# Altium project M1_C5_version1.PrjPcb
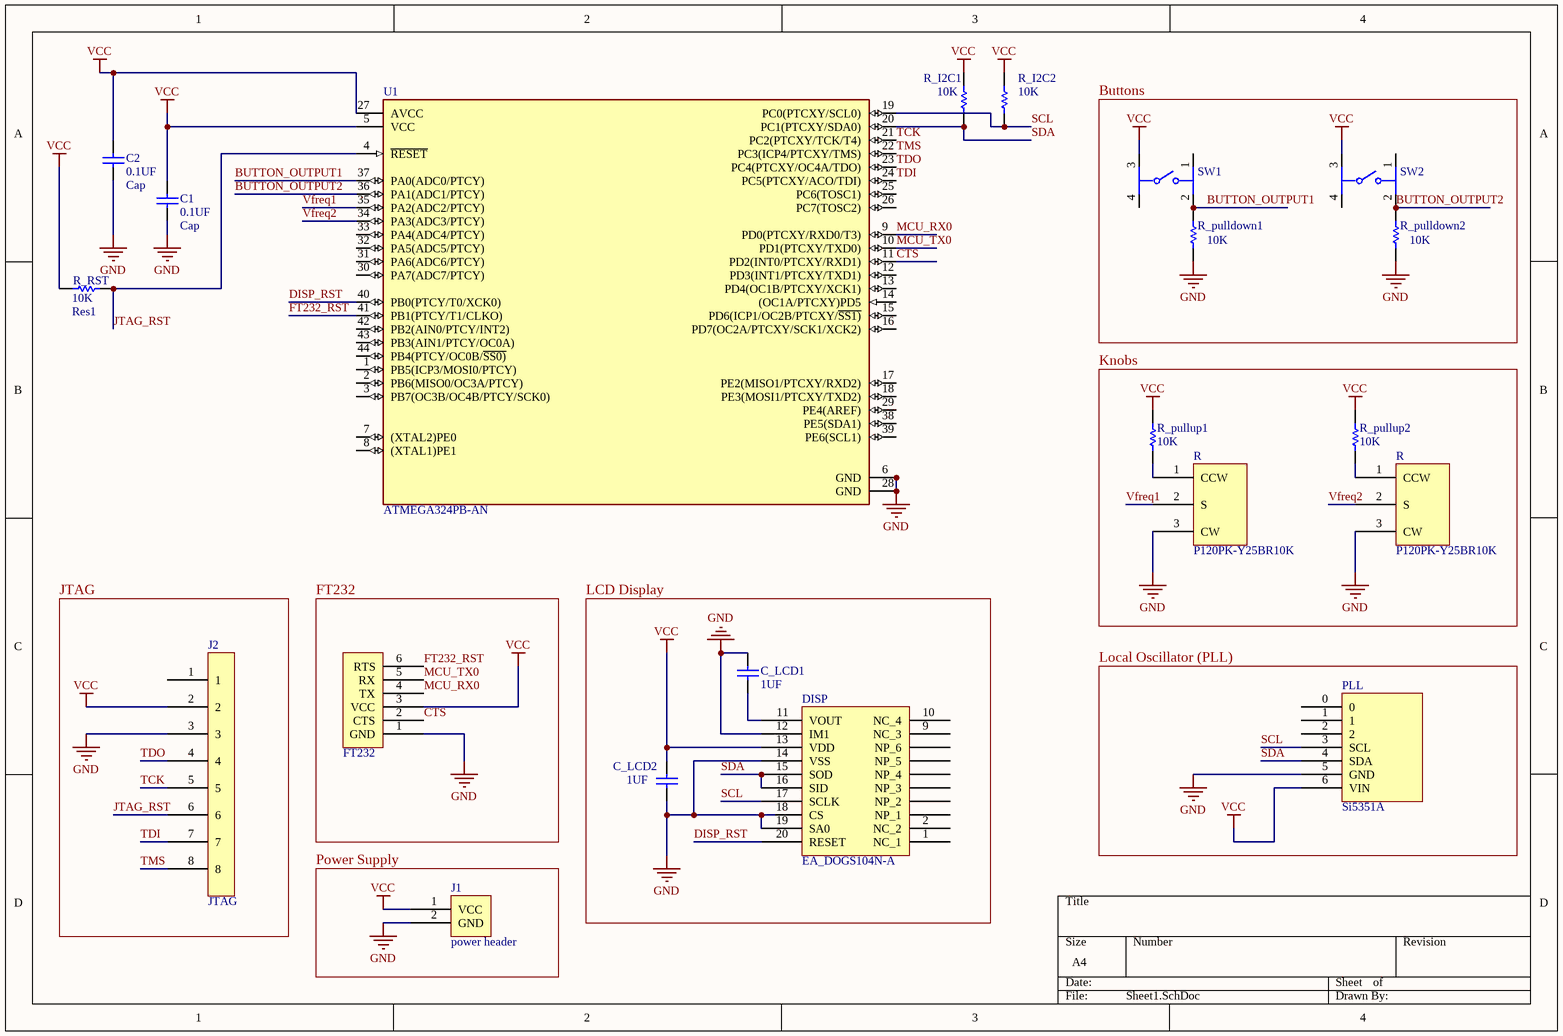
[diagram p0: Sheet1.SchDoc]
1 sheet, 21 parts. Net scope: global (net labels, ports and power ports of the same name join across sheets).
Board file: PCB1.PcbDoc

## Sheet Sheet1.SchDoc
size A4; SheetNumber: 1; SheetTotal: 1

### Parts
(Parts that share a designator on the sheet are numbered #1, #2 ... from top to bottom, then left to right.)
C1  Cap  value 0.1UF  [1206]
C2  Cap  value 0.1UF  [1206]
C_LCD1  value 1UF  [1206]  (hidden comment: Cap)
C_LCD2  value 1UF  [1206]  (hidden comment: Cap)
DISP  EA_DOGS104N-A  [LCD]
FT232  FT232  [FT232]  (value not drawn)
J1  power header  [power header]
J2  JTAG
PLL  Si5351A  [Si5351A]
R#1  P120PK-Y25BR10K  [potentiometer]
R#2  P120PK-Y25BR10K  [potentiometer]
R_I2C1  value 10K  [AXIAL-0.1-RES]  (hidden comment: Res1)
R_I2C2  value 10K  [AXIAL-0.1-RES]  (hidden comment: Res1)
R_pulldown1  value 10K  [AXIAL-0.1-RES]
R_pulldown2  value 10K  [AXIAL-0.1-RES]
R_pullup1  value 10K  [AXIAL-0.1-RES]  (hidden comment: Res1)
R_pullup2  value 10K  [AXIAL-0.1-RES]  (hidden comment: Res1)
R_RST  Res1  value 10K  [AXIAL-0.1-RES]
SW1  PTS645SM43SMTR92LFS  [FP-PTS645SM43SMTR92LFS-MFG]  (value not drawn)
SW2  PTS645SM43SMTR92LFS  [FP-PTS645SM43SMTR92LFS-MFG]  (value not drawn)
U1  ATMEGA324PB-AN  [FP-44A-IPC_B]

### Blocks framed on the sheet
Buttons: R_pulldown1 R_pulldown2 SW1 SW2
Knobs: R#1 R#2 R_pullup1 R_pullup2
JTAG: J2
FT232: FT232
LCD Display: C_LCD1 C_LCD2 DISP
Local Oscillator (PLL): PLL
Power Supply: J1

### Nets
GND: C1.1 C2.1 C_LCD1.2 C_LCD2.1 DISP.12(IM1) DISP.14(VSS) DISP.18(CS) DISP.19(SA0) FT232.1(GND) J1.2(GND) J2.3 PLL.5(GND) R#1.3(CW) R#2.3(CW) R_pulldown1.1 R_pulldown2.1 U1.6(GND) U1.28(GND)
VCC: C1.2 C2.2 C_LCD2.2 DISP.13(VDD) FT232.3(VCC) J1.1(VCC) J2.2 PLL.6(VIN) R_I2C1.2 R_I2C2.2 R_pullup1.2 R_pullup2.2 R_RST.1 SW1.3 SW2.3 U1.5(VCC) U1.27(AVCC)
BUTTON_OUTPUT1: R_pulldown1.2 SW1.2 U1.37(PA0(ADC0/PTCY))
BUTTON_OUTPUT2: R_pulldown2.2 SW2.2 U1.36(PA1(ADC1/PTCY))
CTS: FT232.2(CTS) U1.11(PD2(INT0/PTCXY/RXD1))
DISP_RST: DISP.20(RESET) U1.40(PB0(PTCY/T0/XCK0))
FT232_RST: FT232.6(RTS) U1.41(PB1(PTCY/T1/CLKO))
JTAG_RST: J2.6 R_RST.2 U1.4(~{RESET})
MCU_RX0: FT232.4(TX) U1.9(PD0(PTCXY/RXD0/T3))
MCU_TX0: FT232.5(RX) U1.10(PD1(PTCXY/TXD0))
SCL: DISP.17(SCLK) PLL.3(SCL) R_I2C2.1 U1.19(PC0(PTCXY/SCL0))
SDA: DISP.15(SOD) DISP.16(SID) PLL.4(SDA) R_I2C1.1 U1.20(PC1(PTCXY/SDA0))
TCK: J2.5 U1.21(PC2(PTCXY/TCK/T4))
TDI: J2.7 U1.24(PC5(PTCXY/ACO/TDI))
TDO: J2.4 U1.23(PC4(PTCXY/OC4A/TDO))
TMS: J2.8 U1.22(PC3(ICP4/PTCXY/TMS))
Vfreq1: R#1.2(S) U1.35(PA2(ADC2/PTCY))
Vfreq2: R#2.2(S) U1.34(PA3(ADC3/PTCY))
NetC_LCD1_1: C_LCD1.1 DISP.11(VOUT)
NetR#1_1: R#1.1(CCW) R_pullup1.1
NetR#2_1: R#2.1(CCW) R_pullup2.1

Not connected (* = marked no-connect by the designer): DISP 1(NC_1) 2(NC_2) 9(NC_3) 10(NC_4) ?1(NP_6) ?2(NP_5) ?3(NP_4) ?4(NP_3) ?5(NP_2) ?6(NP_1); J2 1; PLL 0 1 2; SW1 1 4; SW2 1 4; U1 1(PB5(ICP3/MOSI0/PTCY)) 2(PB6(MISO0/OC3A/PTCY)) 3(PB7(OC3B/OC4B/PTCY/SCK0)) 7((XTAL2)PE0) 8((XTAL1)PE1) 12(PD3(INT1/PTCXY/TXD1)) 13(PD4(OC1B/PTCXY/XCK1)) 14((OC1A/PTCXY)PD5) 15(PD6(ICP1/OC2B/PTCXY/~{SS1)}) 16(PD7(OC2A/PTCXY/SCK1/XCK2)) 17(PE2(MISO1/PTCXY/RXD2)) 18(PE3(MOSI1/PTCXY/TXD2)) 25(PC6(TOSC1)) 26(PC7(TOSC2)) 29(PE4(AREF)) 30(PA7(ADC7/PTCY)) 31(PA6(ADC6/PTCY)) 32(PA5(ADC5/PTCY)) 33(PA4(ADC4/PTCY)) 38(PE5(SDA1)) 39(PE6(SCL1)) 42(PB2(AIN0/PTCY/INT2)) 43(PB3(AIN1/PTCY/OC0A)) 44(PB4(PTCY/OC0B/~{SS0)})

### Library data of the parts
C1 C2 = CAP CER 0.1UF 50V X7R 1206: Capacitor; Manufacturer Part Number: 885012208087; Designator: C?; Voltage Rating: 50V; Published: 8-Jun-2000; LatestRevisionDate: 17-Jul-2002; LatestRevisionNote: Re-released for DXP Platform.; Publisher: Altium Limited
C_LCD1 C_LCD2 = CAP CER 1UF 50V X7R 1206: Capacitor; Manufacturer Part Number: 885012208093; Designator: C?; Voltage Rating: 50V; Published: 8-Jun-2000; LatestRevisionDate: 17-Jul-2002; LatestRevisionNote: Re-released for DXP Platform.; Publisher: Altium Limited
DISP = EA_DOGS104N-A: LCD display
PLL = Si5351A: PLL
R#1 R#2 = P120PK-Y25BR10K: potentiometer
R_I2C1 R_I2C2 R_pulldown1 R_pulldown2 R_pullup1 R_pullup2 R_RST = RES 10K OHM 5% 1/4W AXIAL: Resistor; Manufacturer Part Number: CFR-25JB-52-10K; Designator: R?; Power Rating: 1/4W; Tolerance: 0.05; Published: 8-Jun-2000; LatestRevisionDate: 17-Jul-2002; LatestRevisionNote: Re-released for DXP Platform.; Publisher: Altium Limited
SW1 SW2 = CMP-2000-05160-2: SWITCH TACTILE SPST-NO 0.05A 12V; Contact Resistance: 100mR; Throw Configuration: SPST; Illumination Type: Non-Illuminated; Mechanical Life: 100000Cycles; Current Rating: 50mA; Switch Function: Off-Mom; Actuator Length: 0.85mm; Actuator Material: Nylon; Actuator Type: Standard; Operating Force: 160gf; Min Operating Temperature: -20°C; REACH SVHC: No SVHC; Termination: Gull Wing; Case/Package: SMD/SMT; Packaging: Tape and Reel; Mount: Surface Mount; Voltage Rating (DC): 12V; Orientation: Straight; Lead Free: Lead Free; Contact Material: Silver; Color: Black; Max Current Rating: 50mA; Contact Plating: Silver; Depth: 9mm; Package Quantity: 1; Max Voltage Rating (DC): 12V; Length: 6mm; Max Operating Temperature: 60°C
U1 = CMP-06276-000172-1: IC MCU 8BIT 32KB FLASH 44TQFP; Interface: I2C; Core Architecture: AVR; Oscillator Type: Internal; Frequency: 20MHz; Peripherals: Brown-out Detect/Reset; Number of I/Os: 39; Packaging: Tray; Case/Package: TQFP; Memory Size: 32KB; RoHS Compliant: Yes; Min Operating Temperature: -40°C; Max Operating Temperature: 105°C; Memory Type: FLASH